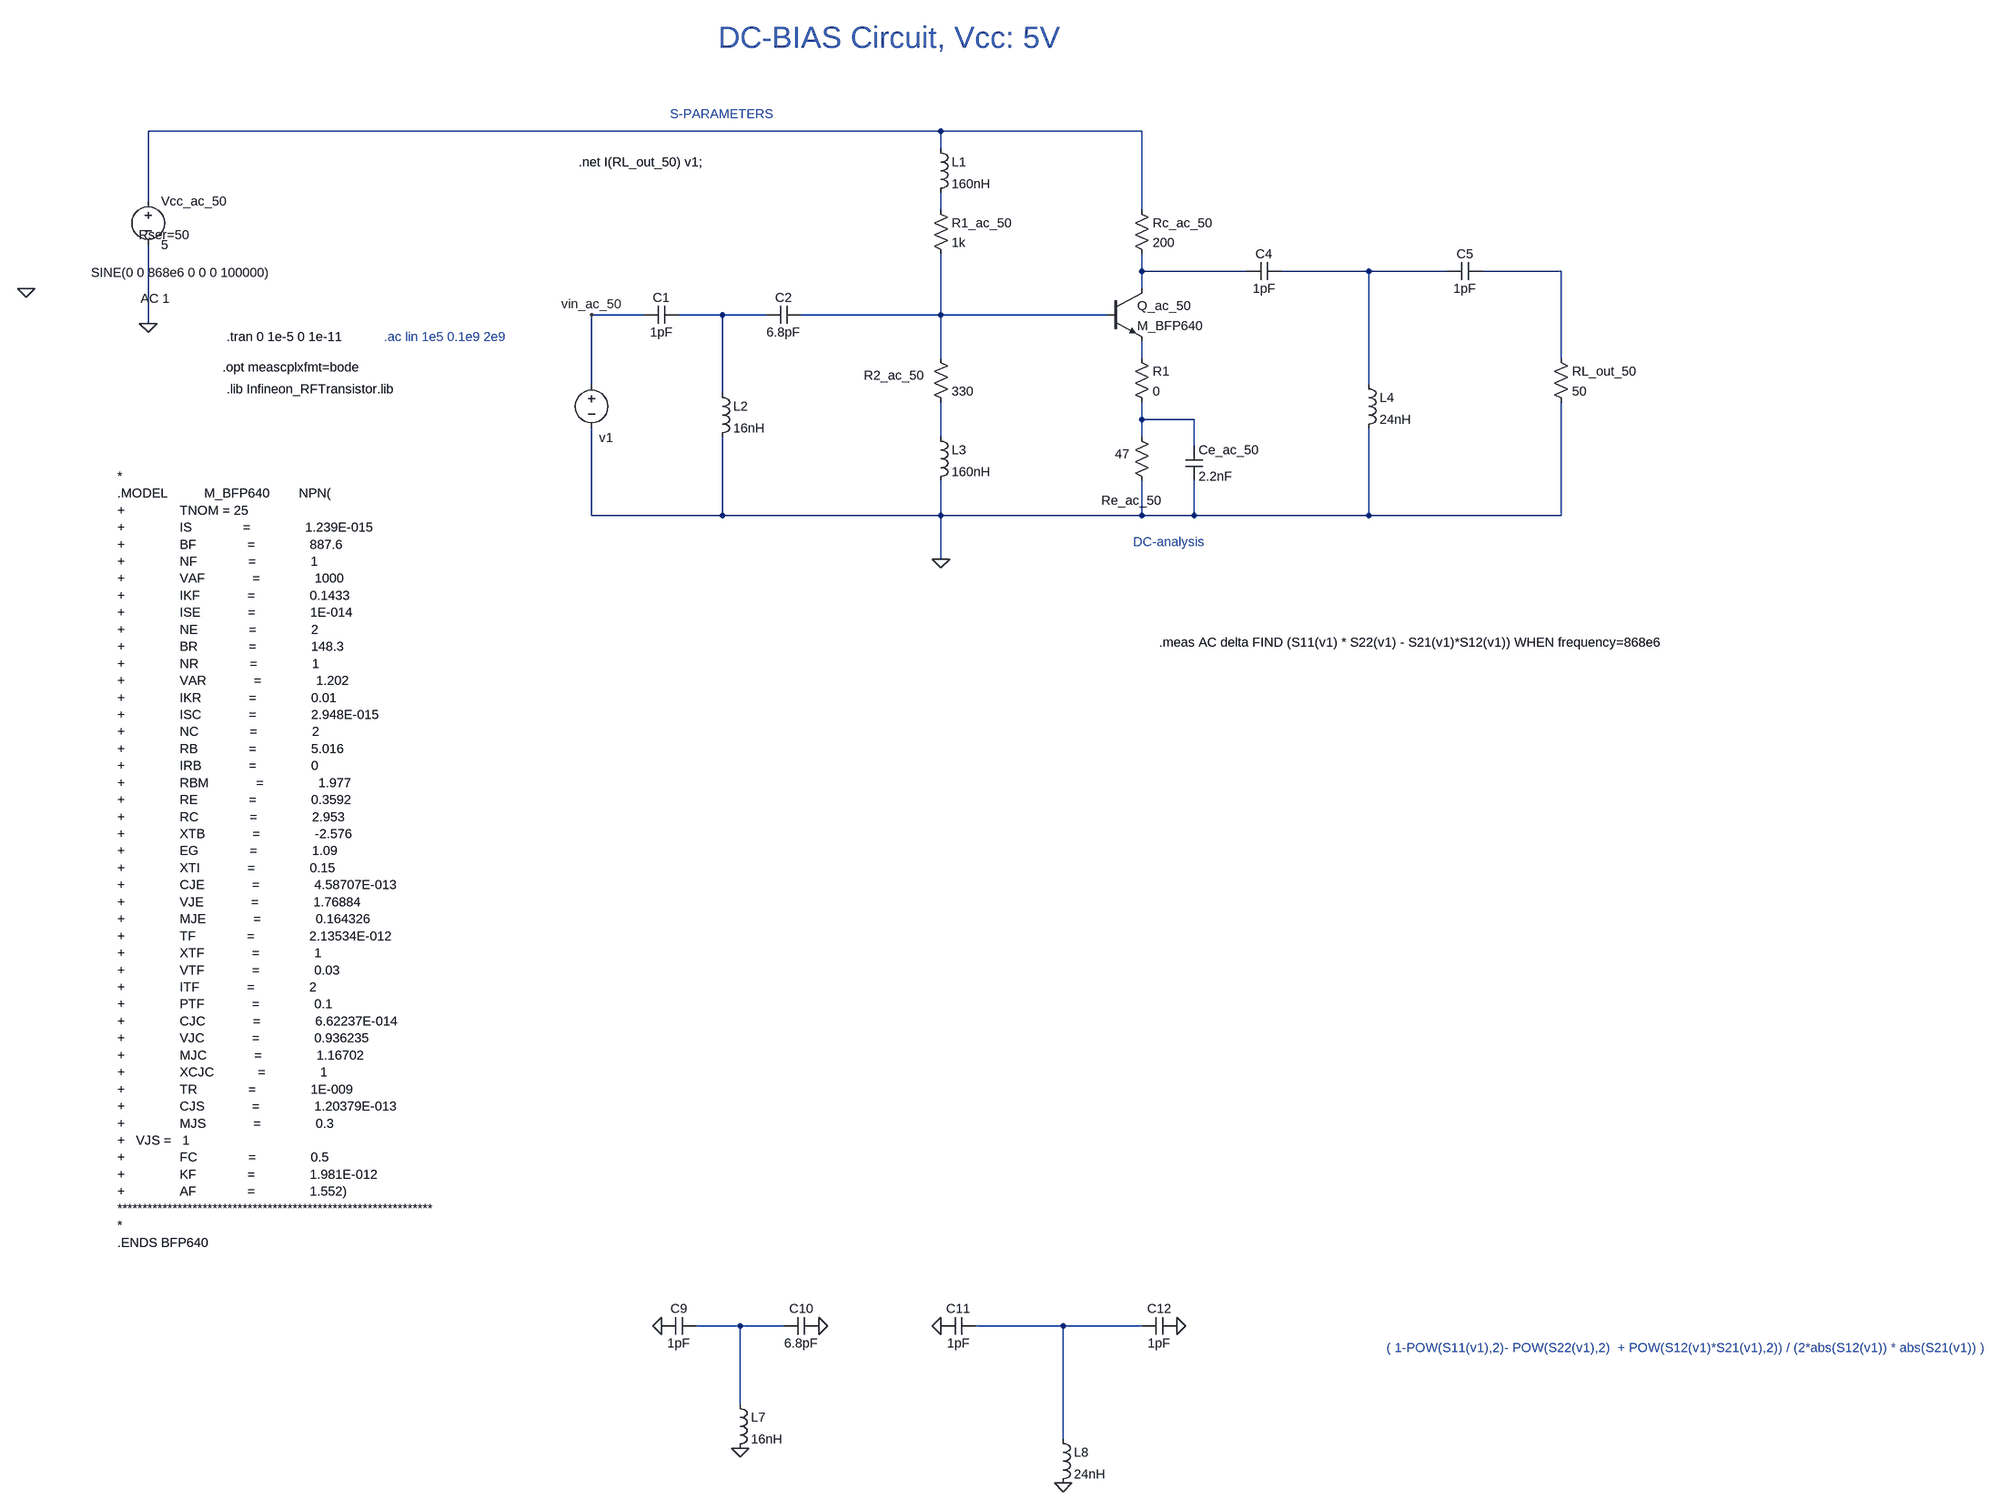
[diagram p0: schematic GAIN_BLOCK_V1.asc]
GAIN_BLOCK_V1.asc, the LTspice schematic file:
Version 4
SHEET 1 9212 2740
WIRE 2736 -288 1232 -288
WIRE 3104 -288 2736 -288
WIRE 2736 -256 2736 -288
WIRE 1232 -160 1232 -288
WIRE 2736 -144 2736 -176
WIRE 3104 -144 3104 -288
WIRE 3104 -32 3104 -64
WIRE 3296 -32 3104 -32
WIRE 3520 -32 3360 -32
WIRE 3664 -32 3520 -32
WIRE 3872 -32 3728 -32
WIRE 3104 0 3104 -32
WIRE 2192 48 2096 48
WIRE 2336 48 2256 48
WIRE 2416 48 2336 48
WIRE 2736 48 2736 -64
WIRE 2736 48 2480 48
WIRE 3040 48 2736 48
WIRE 1232 64 1232 -80
WIRE 2736 128 2736 48
WIRE 3104 128 3104 96
WIRE 3872 128 3872 -32
WIRE 2096 176 2096 48
WIRE 3520 176 3520 -32
WIRE 2336 192 2336 48
WIRE 3104 240 3104 208
WIRE 3200 240 3104 240
WIRE 2736 272 2736 208
WIRE 3104 272 3104 240
WIRE 3200 288 3200 240
WIRE 2096 416 2096 256
WIRE 2336 416 2336 272
WIRE 2336 416 2096 416
WIRE 2736 416 2736 352
WIRE 2736 416 2336 416
WIRE 3104 416 3104 352
WIRE 3104 416 2736 416
WIRE 3200 416 3200 352
WIRE 3200 416 3104 416
WIRE 3520 416 3520 256
WIRE 3520 416 3200 416
WIRE 3872 416 3872 208
WIRE 3872 416 3520 416
WIRE 2736 496 2736 416
WIRE 2368 1904 2288 1904
WIRE 2448 1904 2368 1904
WIRE 2960 1904 2800 1904
WIRE 3104 1904 2960 1904
WIRE 2368 2048 2368 1904
WIRE 2960 2112 2960 1904
FLAG 1232 64 0
FLAG 2736 496 0
FLAG 2096 48 vin_ac_50
FLAG 0 0 0
FLAG 2224 1904 0
FLAG 2368 2128 0
FLAG 2512 1904 0
FLAG 2736 1904 0
FLAG 2960 2192 0
FLAG 3168 1904 0
SYMBOL voltage 1232 -176 R0
WINDOW 123 0 0 Left 0
WINDOW 39 0 0 Left 0
SYMATTR InstName Vcc_ac_50
SYMATTR Value 5
SYMBOL npn 3040 0 R0
SYMATTR InstName Q_ac_50
SYMATTR Value M_BFP640
SYMBOL res 2720 -160 R0
SYMATTR InstName R1_ac_50
SYMATTR Value 1k
SYMBOL res 2720 112 R0
WINDOW 0 -125 47 Left 2
SYMATTR InstName R2_ac_50
SYMATTR Value 330
SYMBOL res 3088 256 R0
WINDOW 0 -58 132 Left 2
WINDOW 3 -33 47 Left 2
SYMATTR InstName Re_ac_50
SYMATTR Value 47
SYMBOL res 3088 -160 R0
SYMATTR InstName Rc_ac_50
SYMATTR Value 200
SYMBOL res 3856 112 R0
SYMATTR InstName RL_out_50
SYMATTR Value 50
SYMBOL cap 3184 288 R0
SYMATTR InstName Ce_ac_50
SYMATTR Value 2.2nF
SYMBOL voltage 2096 160 R0
WINDOW 0 14 113 Left 2
WINDOW 3 -969 -189 Left 2
WINDOW 123 -878 -142 Left 2
WINDOW 39 -881 -258 Left 2
SYMATTR InstName v1
SYMATTR Value SINE(0 0 868e6 0 0 0 100000)
SYMATTR Value2 AC 1
SYMATTR SpiceLine Rser=50
SYMBOL ind 2720 -272 R0
SYMATTR InstName L1
SYMATTR Value 160nH
SYMBOL ind 2720 256 R0
SYMATTR InstName L3
SYMATTR Value 160nH
SYMBOL res 3088 112 R0
SYMATTR InstName R1
SYMATTR Value 0
SYMBOL cap 2256 32 R90
WINDOW 0 0 32 VBottom 2
WINDOW 3 32 32 VTop 2
SYMATTR InstName C1
SYMATTR Value 1pF
SYMBOL cap 2480 32 R90
WINDOW 0 0 32 VBottom 2
WINDOW 3 32 32 VTop 2
SYMATTR InstName C2
SYMATTR Value 6.8pF
SYMBOL ind 2320 176 R0
SYMATTR InstName L2
SYMATTR Value 16nH
SYMBOL cap 3360 -48 R90
WINDOW 0 0 32 VBottom 2
WINDOW 3 32 32 VTop 2
SYMATTR InstName C4
SYMATTR Value 1pF
SYMBOL cap 3728 -48 R90
WINDOW 0 0 32 VBottom 2
WINDOW 3 32 32 VTop 2
SYMATTR InstName C5
SYMATTR Value 1pF
SYMBOL ind 3504 160 R0
SYMATTR InstName L4
SYMATTR Value 24nH
SYMBOL cap 2288 1888 R90
WINDOW 0 0 32 VBottom 2
WINDOW 3 32 32 VTop 2
SYMATTR InstName C9
SYMATTR Value 1pF
SYMBOL cap 2512 1888 R90
WINDOW 0 0 32 VBottom 2
WINDOW 3 32 32 VTop 2
SYMATTR InstName C10
SYMATTR Value 6.8pF
SYMBOL ind 2352 2032 R0
SYMATTR InstName L7
SYMATTR Value 16nH
SYMBOL cap 2800 1888 R90
WINDOW 0 0 32 VBottom 2
WINDOW 3 32 32 VTop 2
SYMATTR InstName C11
SYMATTR Value 1pF
SYMBOL cap 3168 1888 R90
WINDOW 0 0 32 VBottom 2
WINDOW 3 32 32 VTop 2
SYMATTR InstName C12
SYMATTR Value 1pF
SYMBOL ind 2944 2096 R0
SYMATTR InstName L8
SYMATTR Value 24nH
TEXT 3088 464 Left 2 ;DC-analysis
TEXT 2328 -472 Left 5 ;DC-BIAS Circuit, Vcc: 5V
TEXT 1176 344 Left 2 !*\n.MODEL          M_BFP640        NPN(\n+               TNOM = 25\n+               IS              =               1.239E-015\n+               BF              =               887.6\n+               NF              =               1\n+               VAF             =               1000\n+               IKF             =               0.1433\n+               ISE             =               1E-014\n+               NE              =               2\n+               BR              =               148.3\n+               NR              =               1\n+               VAR             =               1.202\n+               IKR             =               0.01\n+               ISC             =               2.948E-015\n+               NC              =               2\n+               RB              =               5.016\n+               IRB             =               0\n+               RBM             =               1.977\n+               RE              =               0.3592\n+               RC              =               2.953\n+               XTB             =               -2.576\n+               EG              =               1.09\n+               XTI             =               0.15\n+               CJE             =               4.58707E-013\n+               VJE             =               1.76884\n+               MJE             =               0.164326\n+               TF              =               2.13534E-012\n+               XTF             =               1\n+               VTF             =               0.03\n+               ITF             =               2\n+               PTF             =               0.1\n+               CJC             =               6.62237E-014\n+               VJC             =               0.936235\n+               MJC             =               1.16702\n+               XCJC            =               1\n+               TR              =               1E-009\n+               CJS             =               1.20379E-013\n+               MJS             =               0.3\n+   VJS =   1\n+               FC              =               0.5\n+               KF              =               1.981E-012\n+               AF              =               1.552)\n***************************************************************\n*\n.ENDS BFP640
TEXT 1664 88 Left 2 ;.ac lin 1e5 0.1e9 2e9
TEXT 1376 88 Left 2 !.tran 0 1e-5 0 1e-11
TEXT 2072 -232 Left 2 !.net I(RL_out_50) v1;
TEXT 1368 144 Left 2 !.opt meascplxfmt=bode
TEXT 2240 -320 Left 2 ;S-PARAMETERS
TEXT 1376 184 Left 2 !.lib Infineon_RFTransistor.lib
TEXT 3552 1944 Left 2 ;( 1-POW(S11(v1),2)- POW(S22(v1),2)  + POW(S12(v1)*S21(v1),2)) / (2*abs(S12(v1)) * abs(S21(v1)) )
TEXT 3136 648 Left 2 !.meas AC delta FIND (S11(v1) * S22(v1) - S21(v1)*S12(v1)) WHEN frequency=868e6

The netlist it stands for:
* GAIN_BLOCK_V1.asc
Vcc_ac_50 N001 0 5
Q_ac_50 N003 N007 N008 0 M_BFP640
R1_ac_50 N002 N007 1k
R2_ac_50 N007 N010 330
Re_ac_50 N009 0 47
Rc_ac_50 N001 N003 200
RL_out_50 N005 0 50
Ce_ac_50 N009 0 2.2nF
v1 vin_ac_50 0 SINE(0 0 868e6 0 0 0 100000) AC 1 Rser=50
L1 N001 N002 160nH
L3 N010 0 160nH
R1 N008 N009 0
C1 N006 vin_ac_50 1pF
C2 N007 N006 6.8pF
L2 N006 0 16nH
C4 N004 N003 1pF
C5 N005 N004 1pF
L4 N004 0 24nH
C9 N011 0 1pF
C10 0 N011 6.8pF
L7 N011 0 16nH
C11 N012 0 1pF
C12 0 N012 1pF
L8 N012 0 24nH
.model NPN NPN
.model PNP PNP
.lib standard.bjt
* DC-analysis
* DC-BIAS Circuit, Vcc: 5V
*
.MODEL          M_BFP640        NPN(
+               TNOM = 25
+               IS              =               1.239E-015
+               BF              =               887.6
+               NF              =               1
+               VAF             =               1000
+               IKF             =               0.1433
+               ISE             =               1E-014
+               NE              =               2
+               BR              =               148.3
+               NR              =               1
+               VAR             =               1.202
+               IKR             =               0.01
+               ISC             =               2.948E-015
+               NC              =               2
+               RB              =               5.016
+               IRB             =               0
+               RBM             =               1.977
+               RE              =               0.3592
+               RC              =               2.953
+               XTB             =               -2.576
+               EG              =               1.09
+               XTI             =               0.15
+               CJE             =               4.58707E-013
+               VJE             =               1.76884
+               MJE             =               0.164326
+               TF              =               2.13534E-012
+               XTF             =               1
+               VTF             =               0.03
+               ITF             =               2
+               PTF             =               0.1
+               CJC             =               6.62237E-014
+               VJC             =               0.936235
+               MJC             =               1.16702
+               XCJC            =               1
+               TR              =               1E-009
+               CJS             =               1.20379E-013
+               MJS             =               0.3
+   VJS =   1
+               FC              =               0.5
+               KF              =               1.981E-012
+               AF              =               1.552)
***************************************************************
*
.ENDS BFP640
* .ac lin 1e5 0.1e9 2e9
.tran 0 1e-5 0 1e-11
.net I(RL_out_50) v1;
.opt meascplxfmt=bode
* S-PARAMETERS
.lib Infineon_RFTransistor.lib
* ( 1-POW(S11(v1),2)- POW(S22(v1),2)  + POW(S12(v1)*S21(v1),2)) / (2*abs(S12(v1)) * abs(S21(v1)) )
.meas AC delta FIND (S11(v1) * S22(v1) - S21(v1)*S12(v1)) WHEN frequency=868e6
.backanno
.end